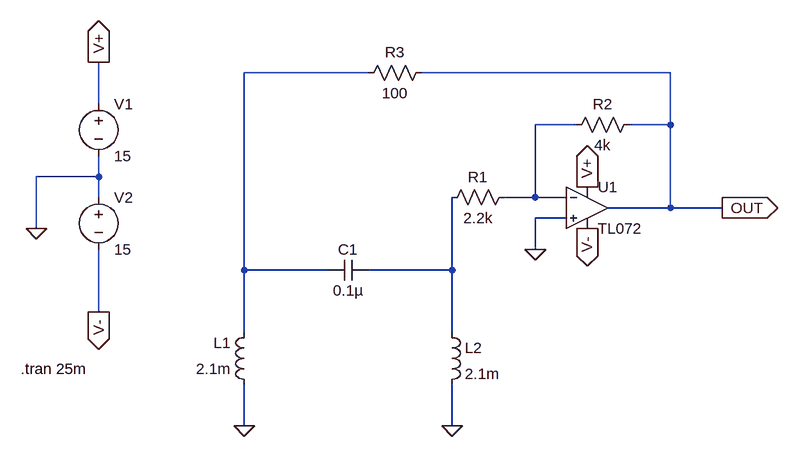
[diagram p0: schematic Hartley.asc]
Hartley.asc, the LTspice schematic file:
Version 4
SHEET 1 2036 680
WIRE 720 -80 528 -80
WIRE 1184 -80 800 -80
WIRE 304 -32 304 -96
WIRE 1040 0 976 0
WIRE 1184 0 1184 -80
WIRE 1184 0 1120 0
WIRE 304 80 304 48
WIRE 304 80 208 80
WIRE 304 112 304 80
WIRE 976 112 976 0
WIRE 976 112 928 112
WIRE 1024 112 976 112
WIRE 1184 128 1184 0
WIRE 1184 128 1088 128
WIRE 1264 128 1184 128
WIRE 1024 144 976 144
WIRE 208 160 208 80
WIRE 976 192 976 144
WIRE 528 224 528 -80
WIRE 656 224 528 224
WIRE 848 224 848 112
WIRE 848 224 720 224
WIRE 304 288 304 192
WIRE 528 320 528 224
WIRE 848 320 848 224
WIRE 528 464 528 400
WIRE 848 464 848 400
FLAG 304 -96 V+
IOPIN 304 -96 Out
FLAG 304 288 V-
IOPIN 304 288 Out
FLAG 208 160 0
FLAG 1056 96 V+
IOPIN 1056 96 Out
FLAG 1056 160 V-
IOPIN 1056 160 Out
FLAG 528 464 0
FLAG 976 192 0
FLAG 1264 128 OUT
IOPIN 1264 128 Out
FLAG 848 464 0
SYMBOL voltage 304 -48 R0
WINDOW 123 0 0 Left 0
WINDOW 39 0 0 Left 0
SYMATTR InstName V1
SYMATTR Value 15
SYMBOL voltage 304 96 R0
WINDOW 123 0 0 Left 0
WINDOW 39 0 0 Left 0
SYMATTR InstName V2
SYMATTR Value 15
SYMBOL cap 720 208 R90
WINDOW 0 0 32 VBottom 2
WINDOW 3 32 32 VTop 2
SYMATTR InstName C1
SYMATTR Value 0.1µ
SYMBOL ind 544 416 R180
WINDOW 0 36 80 Left 2
WINDOW 3 36 40 Left 2
SYMATTR InstName L1
SYMATTR Value 2.1m
SYMBOL ind 832 304 R0
SYMATTR InstName L2
SYMATTR Value 2.1m
SYMBOL res 944 96 R90
WINDOW 0 0 56 VBottom 2
WINDOW 3 32 56 VTop 2
SYMATTR InstName R1
SYMATTR Value 2.2k
SYMBOL res 1136 -16 R90
WINDOW 0 0 56 VBottom 2
WINDOW 3 32 56 VTop 2
SYMATTR InstName R2
SYMATTR Value 4k
SYMBOL res 816 -96 R90
WINDOW 0 0 56 VBottom 2
WINDOW 3 32 56 VTop 2
SYMATTR InstName R3
SYMATTR Value 100
SYMBOL AutoGenerated\\TL072 1056 128 R0
SYMATTR InstName U1
TEXT 184 376 Left 2 !.tran 25m

The netlist it stands for:
* Hartley.asc
V1 V+ 0 15
V2 0 V- 15
C1 N003 N001 0.1µ
L1 0 N001 2.1m
L2 N003 0 2.1m
R1 N002 N003 2.2k
R2 OUT N002 4k
R3 OUT N001 100
* U1: TL072 (symbol AutoGenerated\TL072 not available, pins judged from their places): In+=0 In-=N002 V+=V+ V-=V- OUT=OUT
.tran 25m
.backanno
.end